# Altium schematic sheet Receiver_VLC.SchDoc
size OrCAD B; SheetNumber: 5; SheetTotal: 7
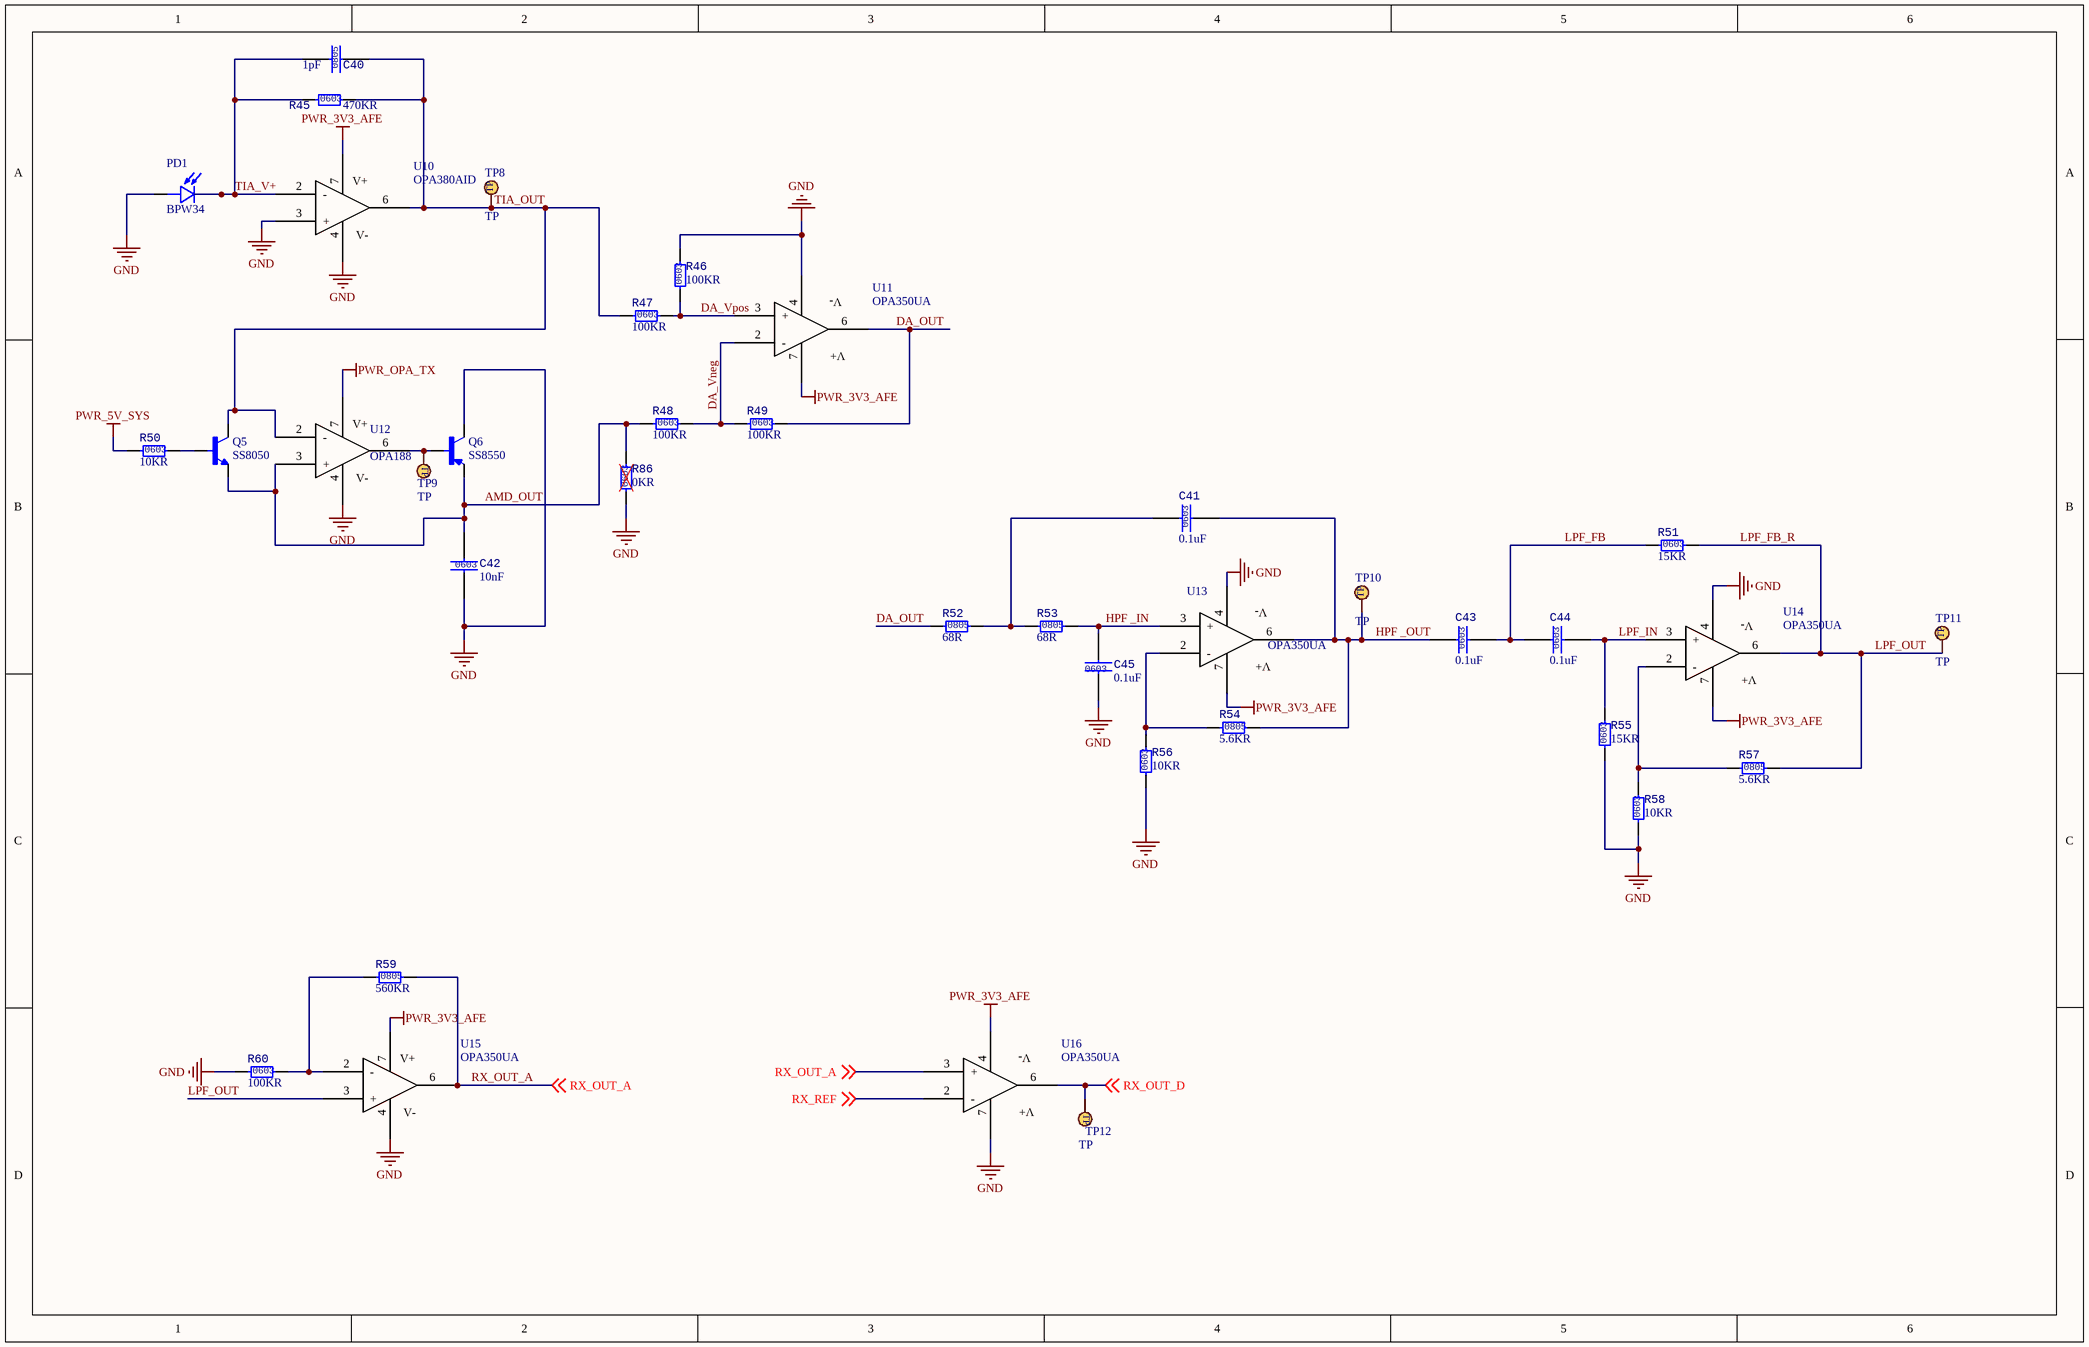
[diagram p0: Receiver_VLC.SchDoc]

## Parts
C40  Size: 0805  [CAPCER 0805 SMD]  (hidden comment: 1pF)
C41  Size: 0603  [CAPCER 0805 SMD]  (hidden comment: 0.1uF)
C42  value 10nF  Size: 0603  [CAPCER 0805 SMD]  (hidden comment: Tụ Gốm 0603 10nF 50V)
C43  Size: 0603  [CAPCER 0805 SMD]  (hidden comment: 0.1uF)
C44  Size: 0603  [CAPCER 0805 SMD]  (hidden comment: 0.1uF)
C45  Size: 0603  [CAPCER 0805 SMD]  (hidden comment: 0.1uF)
PD1  BPW34  [DIP-2]
Q5  SS8050  [SOT23-3]
Q6  SS8550  [SOT23-3]
R45  Size: 0603  [RESC 0603(1608) SMD]  (hidden comment: 470KR)
R46  Size: 0603  [RESC 0603(1608) SMD]  (hidden comment: 100KR)
R47  Size: 0603  [RESC 0603(1608) SMD]  (hidden comment: 100KR)
R48  Size: 0603  [RESC 0603(1608) SMD]  (hidden comment: 100KR)
R49  Size: 0603  [RESC 0603(1608) SMD]  (hidden comment: 100KR)
R50  Size: 0603  [RESC 0603(1608) SMD]  (hidden comment: 10KR)
R51  Size: 0603  [RESC 0603(1608) SMD]  (hidden comment: 15KR)
R52  Size: 0805  [RESC 0805 SMD]  (hidden comment: 68R)
R53  Size: 0805  [RESC 0805 SMD]  (hidden comment: 68R)
R54  Size: 0805  [RESC 0805 SMD]  (hidden comment: 5.6KR)
R55  Size: 0603  [RESC 0603(1608) SMD]  (hidden comment: 15KR)
R56  Size: 0603  [RESC 0603(1608) SMD]  (hidden comment: 10KR)
R57  Size: 0805  [RESC 0805 SMD]  (hidden comment: 5.6KR)
R58  Size: 0603  [RESC 0603(1608) SMD]  (hidden comment: 10KR)
R59  Size: 0805  [RESC 0805 SMD]  (hidden comment: 560KR)
R60  Size: 0603  [RESC 0603(1608) SMD]  (hidden comment: 100KR)
R86  value 0KR  Size: 0603  [RESC 0603(1608) SMD]  (hidden comment: 0R-dni)
TP8  value TP  [TP_THT_1P0]  (hidden comment: TEST POINT)
TP9  value TP  [TP_THT_1P0]  (hidden comment: TEST POINT)
TP10  value TP  [TP_THT_1P0]  (hidden comment: TEST POINT)
TP11  value TP  [TP_THT_1P0]  (hidden comment: TEST POINT)
TP12  value TP  [TP_THT_1P0]  (hidden comment: TEST POINT)
U10  OPA380AID  [8-SOIC-OPA]
U11  OPA350UA  [8-SOIC-OPA]
U12  value OPA188  [8-SOIC-OPA]  (hidden comment: OPA188AID)
U13  OPA350UA  [8-SOIC-OPA]
U14  OPA350UA  [8-SOIC-OPA]
U15  OPA350UA  [8-SOIC-OPA]
U16  OPA350UA  [8-SOIC-OPA]

## Nets
GND: C42.2 C45.1 PD1.A Q6.3(C) R46.2 R55.1 R56.1 R58.1 R60.1 R86.1 U10.3(+) U10.4(GND) U11.4(GND) U12.4(GND) U13.4(GND) U14.4(GND) U15.4(GND) U16.7(VCC)
PWR_3V3_AFE: U10.7(VCC) U11.7(VCC) U13.7(VCC) U14.7(VCC) U15.7(VCC) U16.4(GND)
PWR_5V_SYS: R50.1
PWR_OPA_TX: U12.7(VCC)
AMD_OUT: C42.1 Q5.2(E) Q6.2(E) R48.1 R86.2 U12.3(+)
DA_OUT: R49.2 R52.1 U11.6(OUT_1)
DA_Vneg: R48.2 R49.1 U11.2(-)
DA_Vpos: R46.1 R47.2 U11.3(+)
HPF _IN: C45.2 R53.2 U13.3(+)
HPF _OUT: C41.2 C43.1 R54.2 TP10.1 U13.6(OUT_1)
LPF_FB: C43.2 C44.1 R51.1
LPF_FB_R: R51.2 R57.2 TP11.1 U14.6(OUT_1) U15.3(+)  [also labelled LPF_OUT]
LPF_IN: C44.2 R55.2 U14.3(+)
RX_OUT_A: R59.2 U15.6(OUT_1) U16.3(+) ; off-sheet RX_OUT_A
RX_OUT_D: TP12.1 U16.6(OUT_1) ; off-sheet RX_OUT_D
RX_REF: U16.2(-) ; off-sheet RX_REF
TIA_OUT: C40.2 Q5.3(C) R45.2 R47.1 TP8.1 U10.6(OUT_1) U12.2(-)
TIA_V+: C40.1 PD1.C R45.1 U10.2(-)
NetC41_1: C41.1 R52.2 R53.1
NetQ5_1: Q5.1(B) R50.2
NetQ6_1: Q6.1(B) TP9.1 U12.6(OUT_1)
NetR54_1: R54.1 R56.2 U13.2(-)
NetR57_1: R57.1 R58.2 U14.2(-)
NetR59_1: R59.1 R60.2 U15.2(-)

## Notes on the sheet
- (in symbol DB-0014) V+; V-
- (in symbol DB-0020) V+; V-
- (in symbol DB-0021) V-; V+

## Library data of the parts
C40 = DB-0025: Design Item ID: DB-0025; Value: 1pF; Footprint Type: SMD; Supplier: THEGIOIIC
C41 C43-C45 = DB-0017: CAPACITOR SMD 0.1uF 50V 10% 0603; Design Item ID: DB-0017; Value: 0.1uF; Type: CAPACITOR; Power Rate: N/A; Tolerance: 10%; Footprint Type: SMD; Supplier: THEGIOIIC; Supplier Part Number: Tụ Gốm 0603 100nF (0.1uF) 25V; Supplier Link: https://www.thegioiic.com/tu-gom-0603-100nf-0-1uf-25v
C42 = DB-0079: CAPACITOR SMD 0.01uF 50V 10% 0603; Design Item ID: DB-0079; Type: CAPACITOR; Power Rate: N/A; Tolerance: 10%; Footprint Type: SMD; Supplier: THEGIOIIC; Supplier Part Number: Tụ Gốm 0603 10nF 50V; Supplier Link: https://www.thegioiic.com/tu-gom-0603-100nf-0-1uf-25v
PD1 = DB-0024: Design Item ID: DB-0024; Value: BPW34; Type: PD; Footprint Type: DIP; Size: DIP-2
Q5 = DB-0023: SS8050 Y1 Transistor NPN 25V 1.5A 3 Chân SOT-23; Type: BJT; Design Item ID: DB-0023; Value: SS8050; Footprint Type: SMD; Size: SOT23; Supplier: THEGIOIIC
Q6 = DB-0022: SS8550 Y2 Transistor PNP 25V 1.5A 3 Chân SOT-23; Type: BJT; Design Item ID: DB-0022; Value: SS8550; Footprint Type: SMD; Size: SOT23; Supplier: THEGIOIIC
R45 = DB-0009: RESISTOR SMD 470KR OHM 1% 100mW 0603; Power Rate: 100mW; Design Item ID: DB-0009; Type: RESISTOR; Value: 470KR; Tolerance: 1%; Footprint Type: SMD; Supplier: THEGIOIIC; Supplier Part Number: Điện Trở 470 KOhm 0603 1%; Supplier Link: https://www.thegioiic.com/dien-tro-470-kohm-0603-1-
R46-R49 R60 = DB-0008: RESISTOR SMD 100KR OHM 1% 100mW 0603; Power Rate: 100mW; Design Item ID: DB-0008; Value: 100KR; Type: RESISTOR; Tolerance: 1%; Footprint Type: SMD; Supplier: THEGIOIIC; Supplier Part Number: Điện Trở 100 KOhm 0603 1%; Supplier Link: https://www.thegioiic.com/dien-tro-100-kohm-0603-1-
R50 R56 R58 = DB-0003: RESISTOR SMD 10KR OHM 1% 100mW 0603; Power Rate: 100mW; Design Item ID: DB-0003; Value: 10KR; Type: RESISTOR; Tolerance: 1%; Footprint Type: SMD; Supplier: THEGIOIIC; Supplier Part Number: Điện Trở 10 KOhm 0603 1%; Supplier Link: https://www.thegioiic.com/dien-tro-10-kohm-0603-1-
R51 R55 = Điện Trở 15 KOhm 0603 1%: Power Rate: *; Design Item ID: DB-0034; Value: 15KR; Type: RESISTOR; Footprint Type: SMD; Supplier: THEGIOIIC; Supplier Link: https://www.thegioiic.com/dien-tro-15-kohm-0603-1-
R52 R53 = DB-0033: Điện Trở 68 Ohm 0805 1%; Power Rate: *; Design Item ID: DB-0033; Value: 68R; Type: RESISTOR; Footprint Type: SMD; Supplier: THEGIOIIC; Supplier Link: https://www.thegioiic.com/dien-tro-68-ohm-0805-1-
R54 R57 = DB-0023: RESISTOR SMD 5.6KR OHM 1% 125mW 0805; Power Rate: 125mW; Design Item ID: DB-0023; Value: 5.6KR; Type: RESISTOR; Tolerance: 1%; Footprint Type: SMD; Supplier: THEGIOIIC; Supplier Part Number: Điện Trở 5.6 KOhm 0805 1%; Supplier Link: https://www.thegioiic.com/dien-tro-5-6-kohm-0805-1-
R59 = DB-0026: Power Rate: *; Design Item ID: DB-0026; Value: 560KR; Footprint Type: SMD; Supplier: THEGIOIIC
R86 = DB-0040: RESISTOR SMD 0KR OHM 1% 100mW 0603; Power Rate: 100mW; Design Item ID: DB-0040; Type: RESISTOR; Tolerance: 1%; Footprint Type: SMD; Supplier: THEGIOIIC; Supplier Part Number: Điện Trở 0 Ohm 0603 1%; Supplier Link: https://www.thegioiic.com/dien-tro-0-ohm-0603-1-
TP8-TP12 = DB-0003: Design Item ID: DB-0003; Type: TP; Footprint Type: THT; Size: 1P0
U10 = DB-0020: Design Item ID: DB-0020; Value: OPA380AID; Footprint Type: SMD; Size: 8-SOIC
U11 U13-U16 = DB-0021: Design Item ID: DB-0021; Value: OPA350UA; Footprint Type: SMD; Size: 8-SOIC
U12 = DB-0014: Zero-Drift Amplifier 1 Circuit Rail-to-Rail 8-SOIC; Design Item ID: DB-0014; Type: IC; Power Rate: N/A; Tolerance: N/A; Footprint Type: SMD; Size: 8-SOIC; Supplier: DIGIKEY; Supplier Part Number: OPA188AID; Supplier Link: https://www.digikey.com/en/products/detail/texas-instruments/OPA188AID/4146941